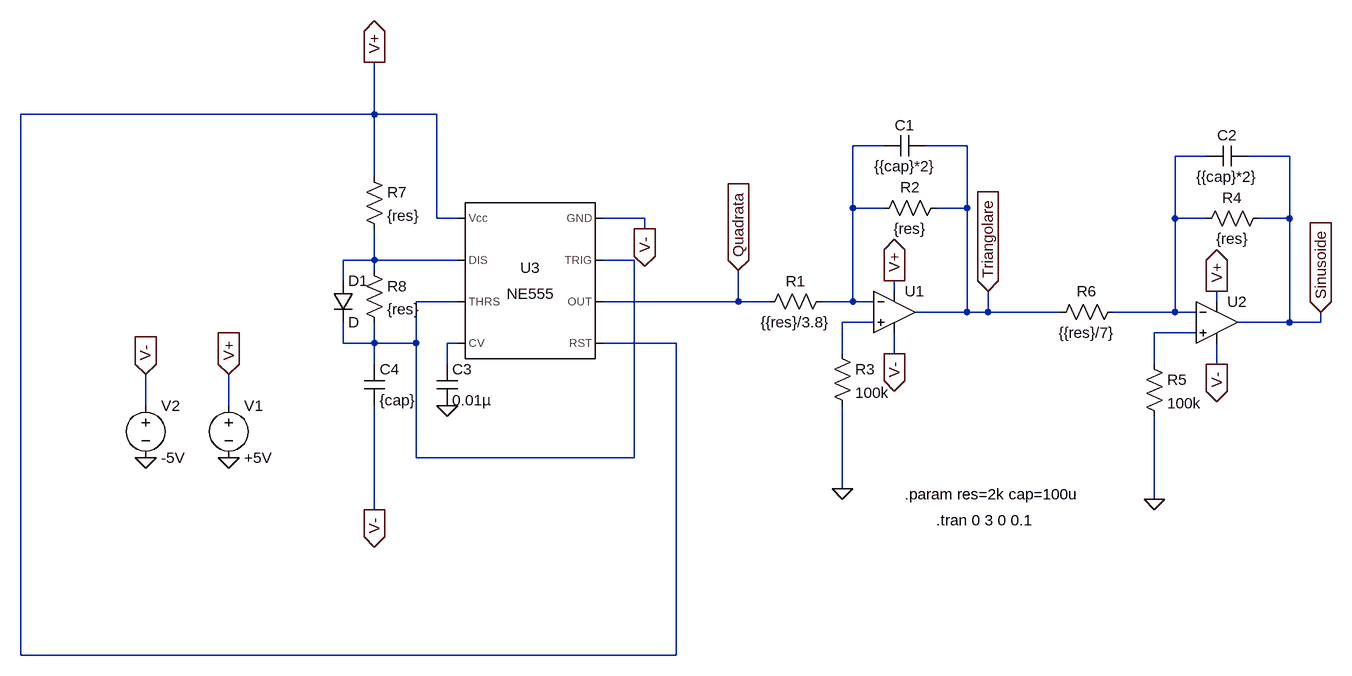
[diagram p0: schematic progetto_PSE_555_variabili_v1.asc]
progetto_PSE_555_variabili_v1.asc, the LTspice schematic file:
Version 4
SHEET 1 2084 680
WIRE -352 -304 -352 -384
WIRE -352 -304 -896 -304
WIRE -256 -304 -352 -304
WIRE 432 -256 384 -256
WIRE 560 -256 496 -256
WIRE 928 -240 880 -240
WIRE 1056 -240 992 -240
WIRE -352 -208 -352 -304
WIRE 384 -160 384 -256
WIRE 432 -160 384 -160
WIRE 560 -160 560 -256
WIRE 560 -160 512 -160
WIRE -256 -144 -256 -304
WIRE -224 -144 -256 -144
WIRE 64 -144 0 -144
WIRE 880 -144 880 -240
WIRE 928 -144 880 -144
WIRE 1056 -144 1056 -240
WIRE 1056 -144 1008 -144
WIRE 64 -128 64 -144
WIRE -352 -80 -352 -128
WIRE -352 -80 -400 -80
WIRE -224 -80 -352 -80
WIRE 48 -80 0 -80
WIRE -352 -64 -352 -80
WIRE -400 -48 -400 -80
WIRE 448 -32 448 -48
WIRE -224 -16 -288 -16
WIRE 208 -16 208 -64
WIRE 208 -16 0 -16
WIRE 256 -16 208 -16
WIRE 384 -16 384 -160
WIRE 384 -16 336 -16
WIRE 416 -16 384 -16
WIRE 944 -16 944 -32
WIRE 560 0 560 -160
WIRE 560 0 480 0
WIRE 592 0 592 -32
WIRE 592 0 560 0
WIRE 704 0 592 0
WIRE 880 0 880 -144
WIRE 880 0 784 0
WIRE 912 0 880 0
WIRE 416 16 368 16
WIRE 1056 16 1056 -144
WIRE 1056 16 976 16
WIRE 1104 16 1104 0
WIRE 1104 16 1056 16
WIRE 912 32 848 32
WIRE -400 48 -400 16
WIRE -352 48 -352 16
WIRE -352 48 -400 48
WIRE -288 48 -288 -16
WIRE -288 48 -352 48
WIRE -224 48 -240 48
WIRE 112 48 0 48
WIRE 368 64 368 16
WIRE 448 64 448 32
WIRE -352 80 -352 48
WIRE -240 80 -240 48
WIRE 848 80 848 32
WIRE 944 80 944 48
WIRE -704 144 -704 96
WIRE -576 144 -576 96
WIRE -288 224 -288 48
WIRE 48 224 48 -80
WIRE 48 224 -288 224
WIRE 368 272 368 144
WIRE 848 288 848 160
WIRE -352 304 -352 144
WIRE -896 528 -896 -304
WIRE 112 528 112 48
WIRE 112 528 -896 528
FLAG 208 -64 Quadrata
IOPIN 208 -64 In
FLAG -576 224 0
FLAG -576 96 V+
IOPIN -576 96 In
FLAG -704 224 0
FLAG -704 96 V-
IOPIN -704 96 In
FLAG -240 144 0
FLAG -352 -384 V+
IOPIN -352 -384 Out
FLAG -352 304 V-
IOPIN -352 304 Out
FLAG 64 -128 V-
IOPIN 64 -128 Out
FLAG 368 272 0
FLAG 448 -48 V+
IOPIN 448 -48 Out
FLAG 448 64 V-
IOPIN 448 64 Out
FLAG 592 -32 Triangolare
IOPIN 592 -32 In
FLAG 848 288 0
FLAG 944 -32 V+
IOPIN 944 -32 Out
FLAG 944 80 V-
IOPIN 944 80 Out
FLAG 1104 0 Sinusoide
IOPIN 1104 0 In
SYMBOL voltage -576 128 R0
WINDOW 123 0 0 Left 0
WINDOW 39 0 0 Left 0
SYMATTR InstName V1
SYMATTR Value +5V
SYMBOL voltage -704 128 R0
WINDOW 123 0 0 Left 0
WINDOW 39 0 0 Left 0
SYMATTR InstName V2
SYMATTR Value -5V
SYMBOL Misc\\NE555 -112 -48 M0
SYMATTR InstName U3
SYMBOL cap -256 80 R0
SYMATTR InstName C3
SYMATTR Value 0.01µ
SYMBOL res -368 -224 R0
SYMATTR InstName R7
SYMATTR Value {res}
SYMBOL res -368 -80 R0
SYMATTR InstName R8
SYMATTR Value {res}
SYMBOL cap -368 80 R0
SYMATTR InstName C4
SYMATTR Value {cap}
SYMBOL diode -416 -48 R0
SYMATTR InstName D1
SYMBOL res 352 -32 R90
WINDOW 0 0 56 VBottom 2
WINDOW 3 32 56 VTop 2
SYMATTR InstName R1
SYMATTR Value {{res}/3.8}
SYMBOL res 528 -176 R90
WINDOW 0 0 56 VBottom 2
WINDOW 3 32 56 VTop 2
SYMATTR InstName R2
SYMATTR Value {res}
SYMBOL cap 496 -272 R90
WINDOW 0 0 32 VBottom 2
WINDOW 3 32 32 VTop 2
SYMATTR InstName C1
SYMATTR Value {{cap}*2}
SYMBOL res 352 48 R0
SYMATTR InstName R3
SYMATTR Value 100k
SYMBOL res 1024 -160 R90
WINDOW 0 0 56 VBottom 2
WINDOW 3 32 56 VTop 2
SYMATTR InstName R4
SYMATTR Value {res}
SYMBOL cap 992 -256 R90
WINDOW 0 0 32 VBottom 2
WINDOW 3 32 32 VTop 2
SYMATTR InstName C2
SYMATTR Value {{cap}*2}
SYMBOL res 832 64 R0
SYMATTR InstName R5
SYMATTR Value 100k
SYMBOL res 800 -16 R90
WINDOW 0 0 56 VBottom 2
WINDOW 3 32 56 VTop 2
SYMATTR InstName R6
SYMATTR Value {{res}/7}
SYMBOL Opamps\\UniversalOpamp2 448 0 R0
SYMATTR InstName U1
SYMBOL Opamps\\UniversalOpamp2 944 16 R0
SYMATTR InstName U2
TEXT 512 320 Left 2 !.tran 0 3 0 0.1
TEXT 464 280 Left 2 !.param res=2k cap=100u

The netlist it stands for:
* progetto_PSE_555_variabili_v1.asc
V1 V+ 0 +5V
V2 V- 0 -5V
XU3 V- N004 Quadrata V+ N007 N004 N003 V+ NE555  ; pins GND TRIG OUT RST CV THRS DIS Vcc
C3 N007 0 0.01µ
R7 V+ N003 {res}
R8 N003 N004 {res}
C4 N004 V- {cap}
D1 N003 N004 D
R1 N001 Quadrata {{res}/3.8}
R2 Triangolare N001 {res}
C1 Triangolare N001 {{cap}*2}
R3 N005 0 100k
R4 Sinusoide N002 {res}
C2 Sinusoide N002 {{cap}*2}
R5 N006 0 100k
R6 N002 Triangolare {{res}/7}
XU1 N005 N001 V+ V- Triangolare level.2 Avol=1Meg GBW=10Meg Slew=10Meg ilimit=25m rail=0 Vos=0 phimargin=45 en=0 enk=0 in=0 ink=0 Rin=500Meg  ; pins IN+ IN- V+ V- OUT
XU2 N006 N002 V+ V- Sinusoide level.2 Avol=1Meg GBW=10Meg Slew=10Meg ilimit=25m rail=0 Vos=0 phimargin=45 en=0 enk=0 in=0 ink=0 Rin=500Meg  ; pins IN+ IN- V+ V- OUT
.model D D
.lib standard.dio
.tran 0 3 0 0.1
.param res=2k cap=100u
.lib NE555.sub
.lib UniversalOpamps2.sub
.backanno
.end